# Altium schematic sheet usb-uart.SchDoc
size A4
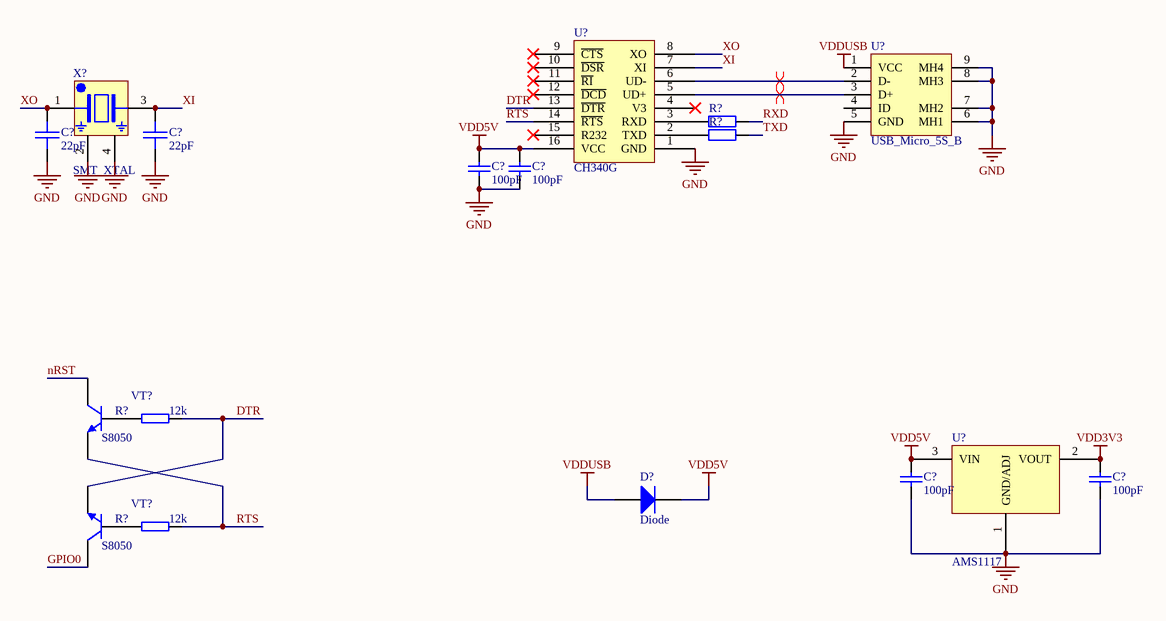
[diagram p0: usb-uart.SchDoc]

## Parts
(Parts that share a designator on the sheet are numbered #1, #2 ... from top to bottom, then left to right.)
C?#1  22pF  [SMT_C_0402]
C?#2  22pF  [SMT_C_0402]
C?#3  value 100pF  [C0805]  (hidden comment: Capacitor)
C?#4  value 100pF  [C0805]  (hidden comment: Capacitor)
C?#5  value 100pF  [C1210]  (hidden comment: Capacitor)
C?#6  value 100pF  [C1210]  (hidden comment: Capacitor)
D?  Diode  [DO214]
R?#1  Resistor  [0805]  (value not drawn)
R?#2  Resistor  [0805]  (value not drawn)
R?#3  12k  [SMT_R_0402]
R?#4  12k  [SMT_R_0402]
U?#1  USB_Micro_5S_B  [USB_MICRO_5S_B]
U?#2  CH340G  [SOP-16]
U?#3  AMS1117  [AMS1117-ADJ]
VT?#1  S8050  [SMT_TRIODE_NPN]
VT?#2  S8050  [SMT_TRIODE_NPN]
X?  SMT_XTAL  [SMT_XTAL_3225]

## Nets
GND: C?#1.2 C?#2.2 C?#3.1 C?#4.1 C?#5.1 C?#6.1 U?#1.5(GND) U?#1.6(MH1) U?#1.7(MH2) U?#1.8(MH3) U?#1.9(MH4) U?#2.1(GND) U?#3.1(GND/ADJ) X?.2(GND) X?.4(GND)
VDD3V3: C?#6.2 U?#3.2(VOUT)
VDD5V: C?#3.2 C?#4.2 C?#5.2 D?.2(K) U?#2.16(VCC) U?#3.3(VIN)
VDDUSB: D?.1(A) U?#1.1(VCC)
DTR: R?#3.2 U?#2.13(~{DTR}) VT?#2.2(E)
GPIO0: VT?#2.3(C)
nRST: VT?#1.3(C)
RTS: R?#4.2 U?#2.14(~{RTS}) VT?#1.2(E)
RXD: R?#1.2
TXD: R?#2.2
XI: C?#2.1 U?#2.7(XI) X?.3(IN/OUT)
XO: C?#1.1 U?#2.8(XO) X?.1(IN/OUT)
NetR?#1_1: R?#1.1 U?#2.3(RXD)
NetR?#2_1: R?#2.1 U?#2.2(TXD)
NetR?#3_1: R?#3.1 VT?#1.1(B)
NetR?#4_1: R?#4.1 VT?#2.1(B)
NetU?#1_2: U?#1.2(D-) U?#2.6(UD-)
NetU?#1_3: U?#1.3(D+) U?#2.5(UD+)

Not connected (* = marked no-connect by the designer): U?#1 4(ID); U?#2 4(V3)* 9(~{CTS})* 10(~{DSR})* 11(~{RI})* 12(~{DCD})* 15(R232)*

## Layout directives
differential pair: NetU?#1_2, NetU?#1_3

## Library data of the parts
C?#1 C?#2 = SMT_C_0402: Surface mount capacitor 0402
C?#3-C?#6 = Capacitor: Ceramic Chip Capacitor - Standard; Note: Footprint corresponds to dimensions for bulk cassette packaging. This case size has tightened tolerances.; Published: 17-Jul-2002; LatestRevisionDate: 19-Mar-2004; LatestRevisionNote: Silkscreen size reduced.; DatasheetDocument: Mar-2001; PackageDocument: Mar-2001; PackageReference: 0805; Publisher: Altium Limited; Code_JEITA: 0805; Code_IPC: 2012[0805]; ComponentLink1Description: Manufacturer Link; ComponentLink1URL: http://www.kemet.com/; ComponentLink2Description: Datasheet; ComponentLink2URL: http://www.kemet.com/kemet/web/homepage/kechome.nsf/vapubfilesname/F3102TA.pdf/$file/F3102TA.pdf
R?#3 R?#4 = SMT_R_0402: Surface mount resistor 0402
U?#1 = USB_Micro_5S_B: USB micro female SMT with 4 fixed foot
U?#2 = CH340G: CH340G USB to serial (UART) bridge
U?#3 = AMS1117: AMS1117 1A LOW DROPOUT VOLTAGE REGULATOR
VT?#1 VT?#2 = SMT_TRIODE_NPN: Surface mount NPN transistor, package SOT-23
X? = SMT_XTAL: Passive crystal oscillator
D? = Diode: Published: 8-Jun-2000; LatestRevisionDate: 17-Jul-2002; LatestRevisionNote: Re-released for DXP Platform.; DatasheetDocument: 6-Aug-1999; PackageReference: DO-35; Publisher: Altium Limited; Code_JEDEC: DO-204-AH; ComponentLink1Description: Manufacturer Link; ComponentLink1URL: http://www.vishay.com/; ComponentLink2Description: Datasheet; ComponentLink2URL: http://www.vishay.com/docs/85588/85588.pdf
R?#1 R?#2 = Resistor: Published: 8-Jun-2000; LatestRevisionDate: 17-Jul-2002; LatestRevisionNote: Re-released for DXP Platform.; PackageReference: AXIAL-0.4; Publisher: Altium Limited